# EAGLE schematic MagController (EAGLE 7.1.0)
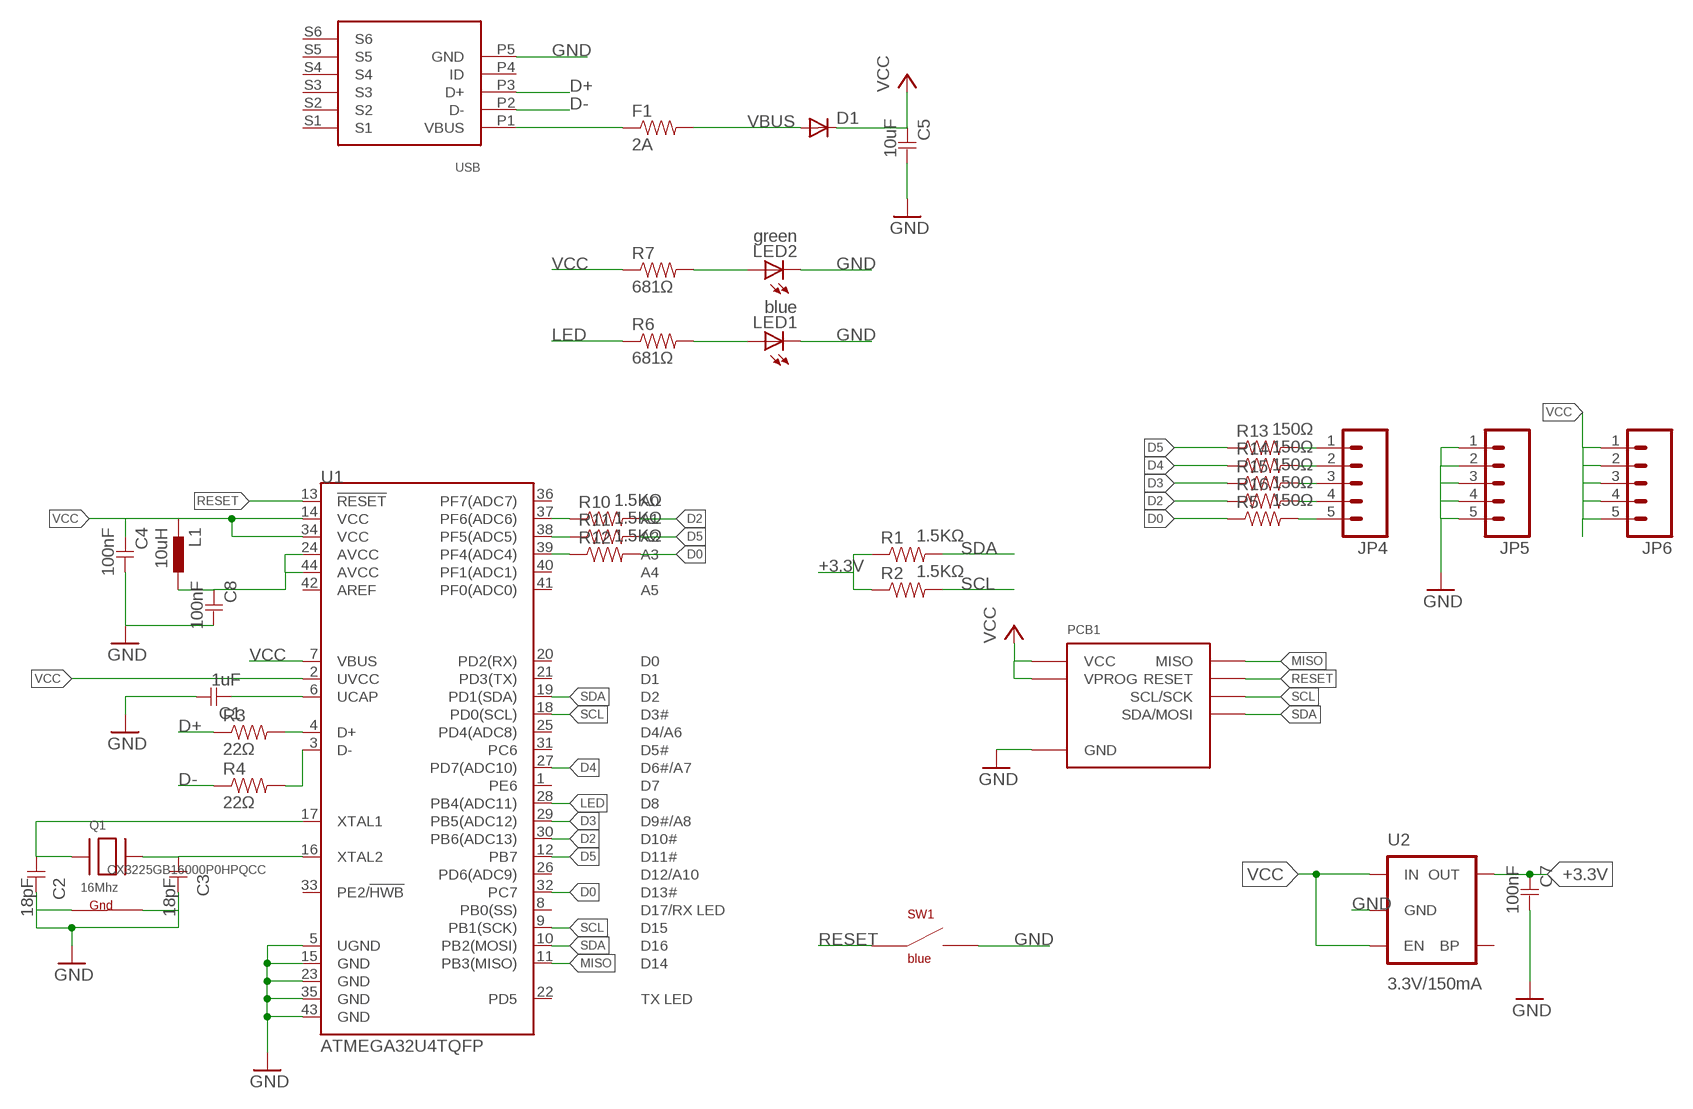
[diagram p0: schematic, sheet 1]

## Parts
C1  1uF  CAPACITOR-1UF  [0603]
C2  18pF  CAPACITOR-18PF  [0603]
C3  18pF  CAPACITOR-18PF  [0603]
C4  100nF  CAPACITOR-100NF  [0603]
C5  10uF  CAPACITOR-10UF  [0603]
C7  100nF  CAPACITOR-100NF  [0603]
C8  100nF  CAPACITOR-100NF  [0603]
D1  DIODESMA  [SMA-DIODE]
F1  2A  RESISTOR-0603  [0603]
JP4  M05NO_SILK  [1X05_NO_SILK]
JP5  M05NO_SILK  [1X05_NO_SILK]
JP6  M05NO_SILK  [1X05_NO_SILK]
L1  10uH  INDUCTOR-10UH  [0603]
LED1  blue  LED-0805-BLUE  [0805-LED]
LED2  green  LED-0805-GREEN  [0805-LED]
PCB1  MAGDEVICE  [MAGDEVICE]
Q1  16Mhz  CRYSTAL-NX3225  [NX3225]
R1  1.5KΩ  RESISTOR-1.5KΩ  [0603]
R2  1.5KΩ  RESISTOR-1.5KΩ  [0603]
R3  22Ω  RESISTOR-22Ω  [0603]
R4  22Ω  RESISTOR-22Ω  [0603]
R5  150Ω  RESISTOR-150Ω  [0603]
R6  681Ω  RESISTOR-681Ω  [0603]
R7  681Ω  RESISTOR-681Ω  [0603]
R10  1.5KΩ  RESISTOR-1.5KΩ  [0603]
R11  1.5KΩ  RESISTOR-1.5KΩ  [0603]
R12  1.5KΩ  RESISTOR-1.5KΩ  [0603]
R13  150Ω  RESISTOR-150Ω  [0603]
R14  150Ω  RESISTOR-150Ω  [0603]
R15  150Ω  RESISTOR-150Ω  [0603]
R16  150Ω  RESISTOR-150Ω  [0603]
SW1  blue  SWITCHBOURNS-7914J  [BOURNS-7914J]
U1  ATMEGA32U4TQFP  [SPARKFUN-DIGITALIC_TQFP44]
U2  3.3V/150mA  V_REG_MIC52053.3V  [SOT23-5]
U3  USBFCI-MICROB  [USB-MICROB-FCI]

## Nets
+3.3V: C7.1 R1.1 R2.1 U2.5(OUT)
AVCC: C8.1 L1.2 U1.24(AVCC) U1.44(AVCC)
D0: R5.1 R12.2 U1.32(PC7)
D2: R10.2 R16.1 U1.30(PB6(ADC13))
D3: R15.1 U1.29(PB5(ADC12))
D4: R14.1 U1.27(PD7(ADC10))
D5: R11.2 R13.1 U1.12(PB7)
D+: R3.1 U3.P3(D+)
D-: R4.1 U3.P2(D-)
GND: C1.2 C2.2 C3.2 C4.2 C5.2 C7.2 C8.2 JP5.1 JP5.2 JP5.3 JP5.4 JP5.5 LED1.C LED2.C PCB1.GNDA(GND) PCB1.GNDB(GND) Q1.2(G1) Q1.4(G2) SW1.NEG$1(NEG1) SW1.NEG$2(NEG1) U1.5(UGND) U1.15(GND) U1.23(GND) U1.35(GND) U1.43(GND) U2.2(GND) U3.P5(GND)
LED: R6.1 U1.28(PB4(ADC11))
MISO: PCB1.MISO U1.11(PB3(MISO))
N$1: C1.1 U1.6(UCAP)
N$2: JP4.1 R13.2
N$3: F1.1 U3.P1(VBUS)
N$4: C3.1 Q1.3(X2) U1.16(XTAL2)
N$5: LED1.A R6.2
N$6: R12.1 U1.39(PF4(ADC4))
N$7: R11.1 U1.38(PF5(ADC5))
N$8: R3.2 U1.4(D+)
N$9: R4.2 U1.3(D-)
N$10: R10.1 U1.37(PF6(ADC6))
N$11: JP4.5 R5.2
N$12: LED2.A R7.2
N$13: JP4.2 R14.2
N$15: C2.1 Q1.1(X1) U1.17(XTAL1)
N$17: JP4.3 R15.2
N$18: JP4.4 R16.2
RESET: PCB1.RESET SW1.POS$1(POS1) SW1.POS$2(POS1) U1.13(!RESET)
SCL: PCB1.SCLA(SCL/SCK) PCB1.SCLB(SCL/SCK) R2.2 U1.9(PB1(SCK)) U1.18(PD0(SCL))
SDA: PCB1.SDAA(SDA/MOSI) PCB1.SDAB(SDA/MOSI) R1.2 U1.10(PB2(MOSI)) U1.19(PD1(SDA))
VBUS: D1.A F1.2
VCC: C4.1 C5.1 D1.C JP6.1 JP6.2 JP6.3 JP6.4 JP6.5 L1.1 PCB1.VCCA(VCC) PCB1.VCCB(VCC) PCB1.VPROG R7.1 U1.2(UVCC) U1.7(VBUS) U1.14(VCC) U1.34(VCC) U2.1(IN) U2.3(EN)
Unconnected: U1.1(PE6) U1.8(PB0(SS)) U1.20(PD2(RX)) U1.21(PD3(TX)) U1.22(PD5) U1.25(PD4(ADC8)) U1.26(PD6(ADC9)) U1.31(PC6) U1.33(PE2/!HWB) U1.36(PF7(ADC7)) U1.40(PF1(ADC1)) U1.41(PF0(ADC0)) U1.42(AREF) U2.4(BP) U3.P4(ID) U3.S1 U3.S2 U3.S3 U3.S4 U3.S5 U3.S6

## Library data of the parts
C1 = Modulo:CAPACITOR: Capacitor; PARTNUM: C0603C105K4RACTU
C2 C3 = Modulo:CAPACITOR: Capacitor; PARTNUM: C0603C180J5GACTU
C4 C7 C8 = Modulo:CAPACITOR: Capacitor; PARTNUM: C0603C104K5RACTU
C5 = Modulo:CAPACITOR: Capacitor; PARTNUM: GRM188R60J106ME47D
D1 = SparkFun-DiscreteSemi:DIODE: Diode These are standard reverse protection diodes and small signal diodes. SMA package can handle up to about 1A. SOD-323 can handle about 200mA. What the SOD-323 package when ordering, there are some mfgs out there that are 5-pin packages.; PARTNUM: SSA33L-E3/61TGICT-ND
F1 = Modulo:RESISTOR: Resistor Basic schematic elements and footprints for 0603, 1206, and PTH resistors.; PARTNUM: MF-PSMF110X-2
JP4-JP6 = SparkFun-Connectors:M05: Header 5 Standard 5-pin 0.1" header. Use with straight break away headers (SKU : PRT-00116), right angle break away headers (PRT-00553), swiss pins (PRT-00743), machine pins (PRT-00117), and female headers (PRT-00115). Molex polarized connector foot print use with SKU : PRT-08230 with associated crimp pins and housings.
L1 = Modulo:INDUCTOR; PARTNUM: LQM18FN100M00
LED1 = Modulo:LED: LED; PARTNUM: LTST-C171TBKT
LED2 = Modulo:LED: LED; PARTNUM: LTST-C171GKT
PCB1 = Modulo:MAGDEVICE
Q1 = Modulo:CRYSTAL; PARTNUM: CX3225GB16000P0HPQCC
R1 R2 R10-R12 = Modulo:RESISTOR: Resistor Basic schematic elements and footprints for 0603, 1206, and PTH resistors.; PARTNUM: ERJ-3EKF1501V
R3 R4 = Modulo:RESISTOR: Resistor Basic schematic elements and footprints for 0603, 1206, and PTH resistors.; PARTNUM: ERJ-3EKF22R0V
R5 R13-R16 = Modulo:RESISTOR: Resistor Basic schematic elements and footprints for 0603, 1206, and PTH resistors.; PARTNUM: ERJ-3EKF1500V
R6 R7 = Modulo:RESISTOR: Resistor Basic schematic elements and footprints for 0603, 1206, and PTH resistors.; PARTNUM: ERJ-3EKF6810V
SW1 = Modulo:SWITCH; PARTNUM: 7914J-1-000E
U1 = SparkFun-DigitalIC:ATMEGA32U4: Atmel 44-pin 8-bit Microcontroller with 32KBytes of ISP Flash and USB Controller ----- Please use the QFN-44-NOPAD_1:1 package for the footprint of all boards using a 32U4. Route traces directly away from the pads as much as possible.; PARTNUM: ATMEGA32U4-AU; PROD_ID: IC-11161
U2 = SparkFun-PowerIC:V_REG_MIC5205: V_REG MIC5219 Standard 3.3V and 5V 150mA LDO voltage regulator in SOT-23 layout. Micrel part MIC5205. BP (by-pass) pin is used to lower output noise with 470pF cap, may be left open.; PARTNUM: MIC5205-3.3YM5 TR; PROD_ID: VREG-00822
U3 = IntegerLabs:USB; PARTNUM: 10118194-0001LF